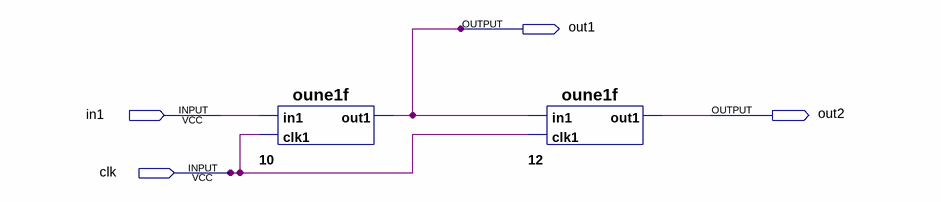
[diagram p0: schematic sheet]
// Quartus schematic pusk5.bdf as structural Verilog: 2 symbols, 4 pins
module pusk5 (
  input  in1,
  input  clk,
  output out1,
  output out2
);

  oune1f u_10 (.in1(in1), .clk1(clk), .out1(out1));
  oune1f u_12 (.in1(out1), .clk1(clk), .out1(out2));
endmodule
